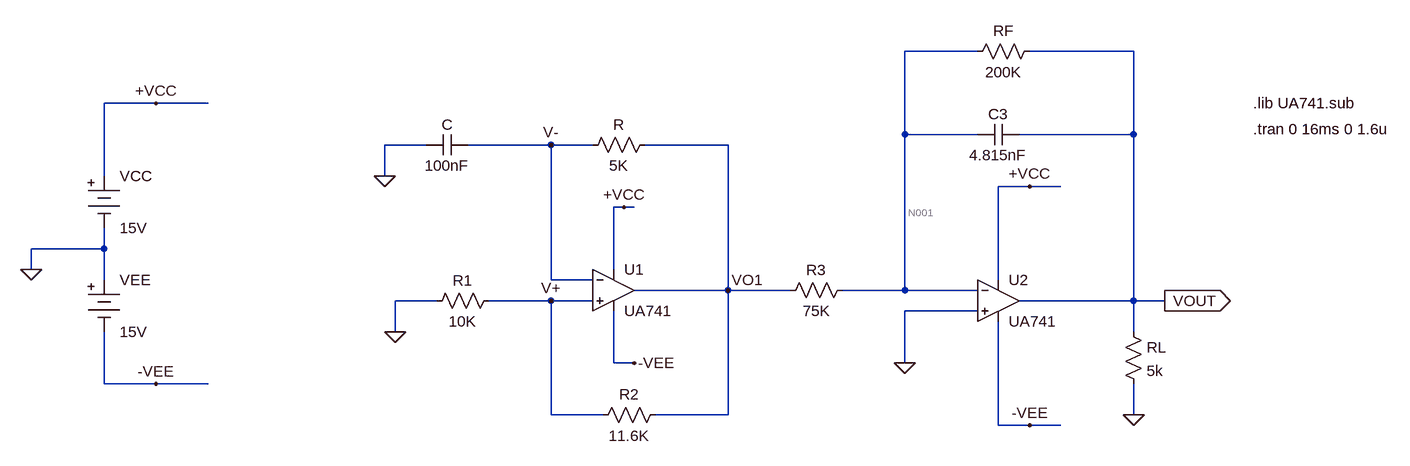
[diagram p0: schematic lab3.asc]
lab3.asc, the LTspice schematic file:
Version 4
SHEET 1 1628 724
WIRE 960 -176 848 -176
WIRE 1200 -176 1040 -176
WIRE -304 -96 -384 -96
WIRE -224 -96 -304 -96
WIRE 848 -48 848 -176
WIRE 960 -48 848 -48
WIRE 1200 -48 1200 -176
WIRE 1200 -48 1024 -48
WIRE 112 -32 48 -32
WIRE 304 -32 176 -32
WIRE 368 -32 304 -32
WIRE 576 -32 448 -32
WIRE -384 16 -384 -96
WIRE 48 16 48 -32
WIRE 1040 32 992 32
WIRE 1088 32 1040 32
WIRE 416 64 400 64
WIRE 432 64 416 64
WIRE -384 128 -384 96
WIRE -384 128 -496 128
WIRE -496 160 -496 128
WIRE 400 160 400 64
WIRE -384 176 -384 128
WIRE 304 176 304 -32
WIRE 368 176 304 176
WIRE 992 176 992 32
WIRE 576 192 576 -32
WIRE 576 192 432 192
WIRE 672 192 576 192
WIRE 848 192 848 -48
WIRE 848 192 752 192
WIRE 960 192 848 192
WIRE 128 208 64 208
WIRE 304 208 208 208
WIRE 368 208 304 208
WIRE 1200 208 1200 -48
WIRE 1200 208 1024 208
WIRE 1248 208 1200 208
WIRE 960 224 848 224
WIRE 64 256 64 208
WIRE 1200 256 1200 208
WIRE 400 304 400 224
WIRE 432 304 400 304
WIRE 848 304 848 224
WIRE -384 336 -384 256
WIRE -304 336 -384 336
WIRE -224 336 -304 336
WIRE 304 384 304 208
WIRE 384 384 304 384
WIRE 576 384 576 192
WIRE 576 384 464 384
WIRE 1200 384 1200 336
WIRE 992 400 992 240
WIRE 1040 400 992 400
WIRE 1088 400 1040 400
FLAG 1248 208 VOUT
IOPIN 1248 208 Out
FLAG -496 160 0
FLAG -304 -96 +VCC
FLAG 1040 32 +VCC
FLAG -304 336 -VEE
FLAG 1040 400 -VEE
FLAG 1200 384 0
FLAG 848 304 0
FLAG 48 16 0
FLAG 64 256 0
FLAG 416 64 +VCC
FLAG 432 304 -VEE
FLAG 304 -32 V-
FLAG 304 208 V+
FLAG 576 192 VO1
SYMBOL Opamps\\opamp2 992 144 R0
SYMATTR InstName U2
SYMATTR Value UA741
SYMBOL res 1184 240 R0
SYMATTR InstName RL
SYMATTR Value 5k
SYMBOL Misc\\battery -384 0 R0
SYMATTR InstName VCC
SYMATTR Value 15V
SYMBOL Misc\\battery -384 160 R0
SYMATTR InstName VEE
SYMATTR Value 15V
SYMBOL cap 1024 -64 R90
WINDOW 0 0 32 VBottom 2
WINDOW 3 32 32 VTop 2
SYMATTR InstName C3
SYMATTR Value 4.815nF
SYMBOL res 768 176 R90
WINDOW 0 0 56 VBottom 2
WINDOW 3 32 56 VTop 2
SYMATTR InstName R3
SYMATTR Value 75K
SYMBOL res 1056 -192 R90
WINDOW 0 0 56 VBottom 2
WINDOW 3 32 56 VTop 2
SYMATTR InstName RF
SYMATTR Value 200K
SYMBOL Opamps\\opamp2 400 128 R0
SYMATTR InstName U1
SYMATTR Value UA741
SYMBOL res 464 -48 R90
WINDOW 0 0 56 VBottom 2
WINDOW 3 32 56 VTop 2
SYMATTR InstName R
SYMATTR Value 5K
SYMBOL res 480 368 R90
WINDOW 0 0 56 VBottom 2
WINDOW 3 32 56 VTop 2
SYMATTR InstName R2
SYMATTR Value 11.6K
SYMBOL cap 176 -48 R90
WINDOW 0 0 32 VBottom 2
WINDOW 3 32 32 VTop 2
SYMATTR InstName C
SYMATTR Value 100nF
SYMBOL res 224 192 R90
WINDOW 0 0 56 VBottom 2
WINDOW 3 32 56 VTop 2
SYMATTR InstName R1
SYMATTR Value 10K
TEXT 1384 -96 Left 2 !.lib UA741.sub
TEXT 1384 -56 Left 2 !.tran 0 16ms 0 1.6u

The netlist it stands for:
* lab3.asc
XU2 0 N001 +VCC -VEE VOUT UA741  ; pins In+ In- V+ V- OUT
RL VOUT 0 5k
VCC +VCC 0 15V
VEE 0 -VEE 15V
C3 VOUT N001 4.815nF
R3 N001 VO1 75K
RF VOUT N001 200K
XU1 V+ V- +VCC -VEE VO1 UA741  ; pins In+ In- V+ V- OUT
R VO1 V- 5K
R2 VO1 V+ 11.6K
C V- 0 100nF
R1 V+ 0 10K
.lib UA741.sub
.tran 0 16ms 0 1.6u
.backanno
.end

* Results of the author's LTspice run, read from the files saved beside the schematic
* Operating Point, zero values left out:
*   V(vout) = 16.08 mV
*   V(-vee) = -15 V
*   V(+vcc) = 15 V
*   V(n001) = 11.11 µV
*   V(vo1) = -33.94 µV
*   V(v-) = -432.7 µV
*   V(v+) = -443.9 µV
*   I(R1) = -44.39 nA
*   I(R2) = 35.34 nA
*   I(R) = 79.76 nA
*   I(Rf) = 80.36 nA
*   I(R3) = 600.6 pA
*   I(Rl) = 3.217 µA
*   I(Vee) = -3.333 mA
*   I(Vcc) = -3.333 mA
*   Ix(u2:1) = 79.74 nA
*   Ix(u2:2) = 79.76 nA
*   Ix(u2:3) = 1.667 mA
*   Ix(u2:4) = -1.667 mA
*   Ix(u2:5) = -3.297 µA
*   Ix(u1:1) = 79.74 nA
*   Ix(u1:2) = 79.76 nA
*   Ix(u1:3) = 1.667 mA
*   Ix(u1:4) = -1.667 mA
*   Ix(u1:5) = -114.5 nA
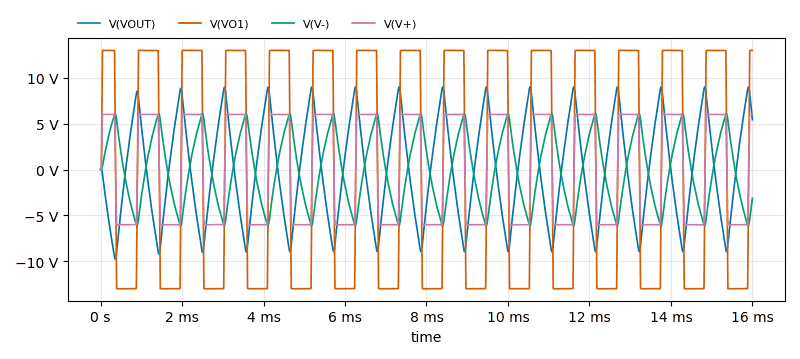
[diagram p1: Transient Analysis of lab3.asc, plotted from the saved traces]
* Transient Analysis, 1 run:
*   V(VOUT): min -9.784 V, max 9.022 V, average -56.84 mV, rms 5.566 V, last 5.451 V
*   V(VO1): min -13.01 V, max 13.01 V, average -95.05 mV, rms 12.61 V, last 13.01 V
*   V(V-): min -6.127 V, max 6.123 V, average 2.58 mV, rms 3.842 V, last -3.141 V
*   V(V+): min -6.024 V, max 6.023 V, average -44.44 mV, rms 5.838 V, last 6.02 V